# EAGLE schematic STM32 Sismin (EAGLE 9.6.2)
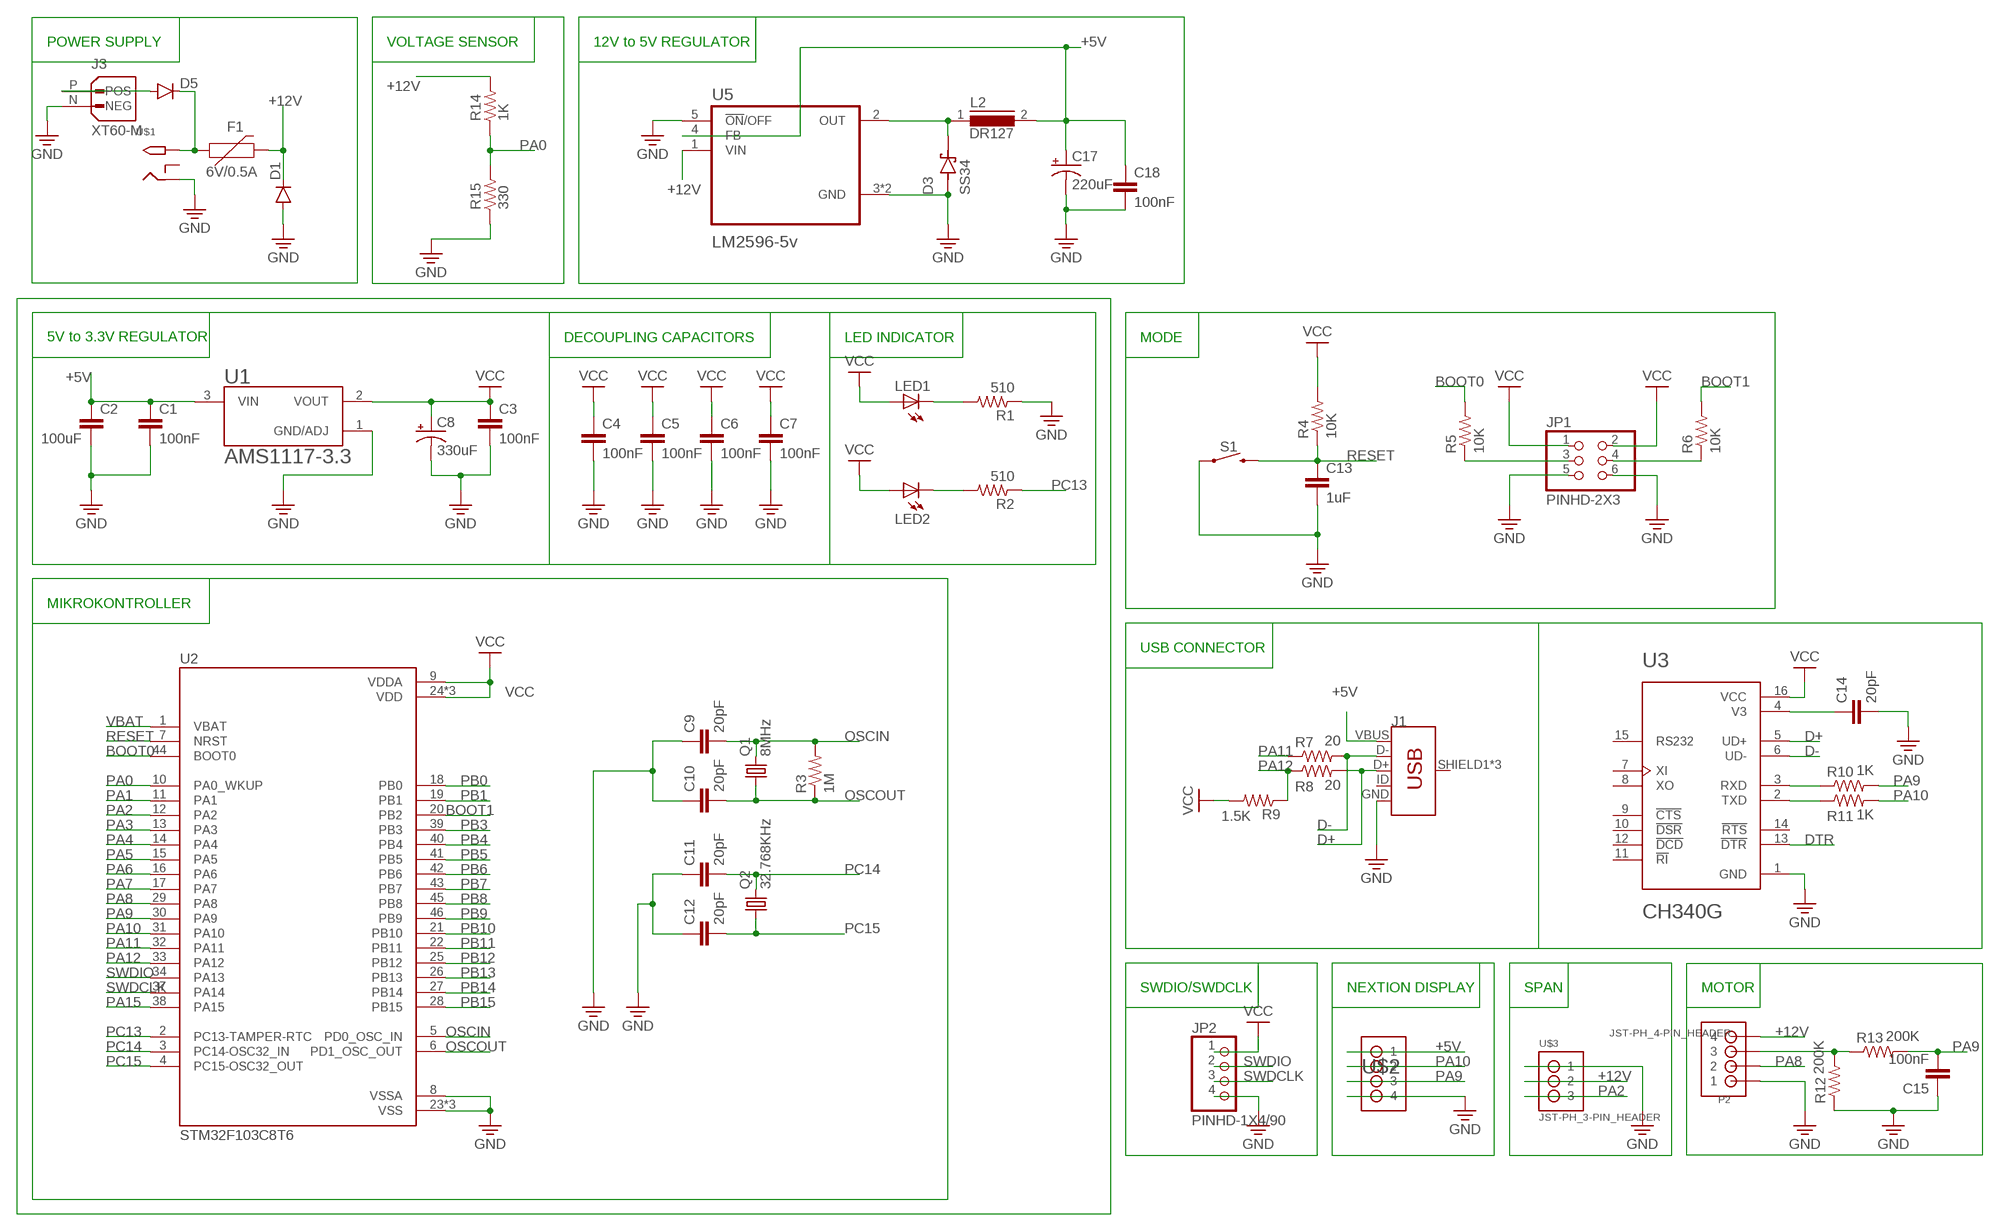
[diagram p0: schematic, sheet 1]

## Parts
C1  100nF  C-EUC1206  [C1206]
C2  100uF  C-EUC1206  [C1206]
C3  100nF  C-EUC1206  [C1206]
C4  100nF  C-EUC1206  [C1206]
C5  100nF  C-EUC1206  [C1206]
C6  100nF  C-EUC1206  [C1206]
C7  100nF  C-EUC1206  [C1206]
C8  330uF  CPOL-USC/6032-28R  [C/6032-28R]
C9  20pF  C-EUC1206  [C1206]
C10  20pF  C-EUC1206  [C1206]
C11  20pF  C-EUC1206  [C1206]
C12  20pF  C-EUC1206  [C1206]
C13  1uF  C-EUC1206  [C1206]
C14  20pF  C-EUC1206  [C1206]
C15  100nF  C-EUC1206  [C1206]
C17  220uF  CPOL-USC/6032-28R  [C/6032-28R]
C18  100nF  C-EUC1206  [C1206]
D1  DIODEDIODE-123FL  [DIODE_SOD-123FL]
D3  SS34  [DIOM6859X262N]
D5  DIODEDIODE-123FL  [DIODE_SOD-123FL]
F1  6V/0.5A  PPTC_HALF-AMP  [1206]
J1  USB_MICRO-BREDUCED_PASTE  [USB-B-MICRO-SMD_RED_PASTE]
J3  XT60-M  [AMASS_XT60-M]
JP1  PINHD-2X3  [2X03]
JP2  PINHD-1X4/90  [1X04/90]
L2  DR127  [DR127]
LED1  LEDCHIPLED_0805  [CHIPLED_0805]
LED2  LEDCHIPLED_0805  [CHIPLED_0805]
P2  JST-PH_4-PIN_HEADER  [JST_B4B-PH_HEADER]
Q1  8MHz  CRYSTALHC49S  [HC49/S]
Q2  32.768KHz  MC-306  [MC-306]
R1  510  RC-MASTER-SMD_R_1206MP  [RC-MASTER-SMD_R1206MP]
R2  510  RC-MASTER-SMD_R_1206MP  [RC-MASTER-SMD_R1206MP]
R3  1M  CRCW08050000Z0EA  [RES_0805]
R4  10K  RC-MASTER-SMD_R_1206MP  [RC-MASTER-SMD_R1206MP]
R5  10K  RC-MASTER-SMD_R_1206MP  [RC-MASTER-SMD_R1206MP]
R6  10K  RC-MASTER-SMD_R_1206MP  [RC-MASTER-SMD_R1206MP]
R7  20  RC-MASTER-SMD_R_1206MP  [RC-MASTER-SMD_R1206MP]
R8  20  RC-MASTER-SMD_R_1206MP  [RC-MASTER-SMD_R1206MP]
R9  1.5K  RC-MASTER-SMD_R_1206MP  [RC-MASTER-SMD_R1206MP]
R10  1K  RC-MASTER-SMD_R_1206MP  [RC-MASTER-SMD_R1206MP]
R11  1K  RC-MASTER-SMD_R_1206MP  [RC-MASTER-SMD_R1206MP]
R12  200K  RC-MASTER-SMD_R_1206MP  [RC-MASTER-SMD_R1206MP]
R13  200K  RC-MASTER-SMD_R_1206MP  [RC-MASTER-SMD_R1206MP]
R14  1K  RC-MASTER-SMD_R_1206MP  [RC-MASTER-SMD_R1206MP]
R15  330  RC-MASTER-SMD_R_1206MP  [RC-MASTER-SMD_R1206MP]
S1  MOMENTARY-SWITCH-SPST-SMD-6.0X3.5MM  [TACTILE_SWITCH_SMD_6.0X3.5MM]
U1  AMS1117-3.3  [SOT229P700X180-4N]
U2  STM32F103C8T6  [QFP50P900X900X160-48N]
U3  CH340G  [SOIC127P600X180-16N]
U5  LM2596-5v  LM2596SX-ADJ/NOPB  [VREG_LM2596SX-ADJ/NOPB]
U$1  2.1MMJACKSMT  [DCJACK_2MM_SMT]
U$2  JST-PH_4-PIN_HEADER  [JST_B4B-PH_HEADER]
U$3  JST-PH_3-PIN_HEADER  [JST_B3B-PH_HEADER]

## Nets
+5V: C1.1 C2.1 C17.+ C18.1 J1.VBUS L2.2 U1.3(VIN) U5.4(FB) U$2.P1
+12V: D1.C F1.2 P2.P4 R14.2 U5.1(VIN) U$3.P2
BOOT0: R5.2 U2.44(BOOT0)
BOOT1: R6.2 U2.20(PB2)
D+: J1.D+ R8.2 U3.5(UD+)
D-: J1.D- R7.2 U3.6(UD-)
DTR: U3.13(!DTR)
GND: C1.2 C2.2 C3.2 C4.2 C5.2 C6.2 C7.2 C8.- C9.1 C10.1 C11.1 C12.1 C13.2 C14.2 C15.1 C17.- C18.2 D1.A D3.A J1.GND J3.N(NEG) JP1.5 JP1.6 JP2.4 P2.P1 R1.1 R12.1 R15.1 S1.1 U1.1(GND/ADJ) U2.8(VSSA) U2.23(VSS) U2.35(VSS) U2.47(VSS) U3.1(GND) U5.3(GND) U5.5(!ON!/OFF) U5.6(GND) U$1.GND(RING) U$2.P4 U$3.P1
N$3: JP1.3 R5.1
N$4: JP1.4 R6.1
N$5: R10.1 U3.3(RXD)
N$6: LED1.C R1.2
N$7: LED2.C R2.2
N$9: R11.1 U3.2(TXD)
N$10: C14.1 U3.4(V3)
N$14: P2.P3 R12.2 R13.1
N$17: D3.C(K) L2.1 U5.2(OUT)
N$22: D5.C F1.1 U$1.PWR2(TIP)
N$28: D5.A J3.P(POS)
OSCIN: C9.2 Q1.2 R3.2 U2.5(PD0_OSC_IN)
OSCOUT: C10.2 Q1.1 R3.1 U2.6(PD1_OSC_OUT)
PA0: R14.1 R15.2 U2.10(PA0_WKUP)
PA1: U2.11(PA1)
PA2: U2.12(PA2) U$3.P3
PA3: U2.13(PA3)
PA4: U2.14(PA4)
PA5: U2.15(PA5)
PA6: U2.16(PA6)
PA7: U2.17(PA7)
PA8: P2.P2 U2.29(PA8)
PA9: C15.2 R10.2 R13.2 U2.30(PA9) U$2.P3
PA10: R11.2 U2.31(PA10) U$2.P2
PA11: R7.1 U2.32(PA11)
PA12: R8.1 R9.1 U2.33(PA12)
PA15: U2.38(PA15)
PB0: U2.18(PB0)
PB1: U2.19(PB1)
PB3: U2.39(PB3)
PB4: U2.40(PB4)
PB5: U2.41(PB5)
PB6: U2.42(PB6)
PB7: U2.43(PB7)
PB8: U2.45(PB8)
PB9: U2.46(PB9)
PB10: U2.21(PB10)
PB11: U2.22(PB11)
PB12: U2.25(PB12)
PB13: U2.26(PB13)
PB14: U2.27(PB14)
PB15: U2.28(PB15)
PC13: R2.1 U2.2(PC13-TAMPER-RTC)
PC14: C11.2 Q2.4 U2.3(PC14-OSC32_IN)
PC15: C12.2 Q2.1 U2.4(PC15-OSC32_OUT)
RESET: C13.1 R4.1 S1.2 U2.7(NRST)
SWDCLK: JP2.3 U2.37(PA14)
SWDIO: JP2.2 U2.34(PA13)
VBAT: U2.1(VBAT)
VCC: C3.1 C4.1 C5.1 C6.1 C7.1 C8.+ JP1.1 JP1.2 JP2.1 LED1.A LED2.A R4.2 R9.2 U1.2(VOUT) U2.9(VDDA) U2.24(VDD) U2.36(VDD) U2.48(VDD) U3.16(VCC)
Unconnected: J1.ID J1.SHIELD1(SHIELD) J1.SHIELD2(SHIELD) J1.SHIELD3(SHIELD) U3.7(XI) U3.8(XO) U3.9(!CTS) U3.10(!DSR) U3.11(!RI) U3.12(!DCD) U3.14(!RTS) U3.15(RS232) U$1.GNDBREAK(RING_SW)

## Notes on the sheet
- POWER SUPPLY | VOLTAGE SENSOR | 12V to 5V REGULATOR
- DECOUPLING CAPACITORS | LED INDICATOR | MODE
- 5V to 3.3V REGULATOR
- MIKROKONTROLLER
- USB CONNECTOR
- SWDIO/SWDCLK | NEXTION DISPLAY | SPAN | MOTOR

## Library data of the parts
C1-C7 C9-C15 C18 = rcl:C-EU: CAPACITOR, European symbol; SPICEPREFIX: C
C8 C17 = rcl:CPOL-US: POLARIZED CAPACITOR, American symbol; SPICEPREFIX: C
D1 D5 = BeagleBone_Blue_R3:DIODE: Diode These are standard reverse protection diodes and small signal diodes. SMA package can handle up to about 1A. SOD-323 can handle about 200mA. What the SOD-323 package when ordering, there are some mfgs out there that are 5-pin packages.
D3 = SS34:SS34: Check availability <https://pricing.snapeda.com/parts/SS34/Taiwan%20Semiconductor/view-part?ref=eda>; AVAILABILITY: In Stock; DESCRIPTION: 3A, 40V, Schottky Rectifier; MF: Taiwan Semiconductor; MP: SS34; PACKAGE: SMC-2 Taiwan Semiconductor; PRICE: None; PURCHASE-URL: https://pricing.snapeda.com/search/part/SS34/?ref=eda
F1 = SparkFun-Fuses:PPTC: Resettable Fuse PPTC Resettable Fuse. Really a sort of resistor with a polymeric positive temperature coefficient whose resistance increases dramatically with an increase in temperature. When heated by the power passing through the resistance rises causing the current to be limited, protecting the circuit. This is achieved by the transition of the polymer from a crystalline to an amorphous state where the conductive carbon separates breaking the conductive pathways found in the cool crystalline structure. When a PPTC cools back down it resumes conducting letting the circuit turn back on. SparkFun Products: SparkFun RedBoard - Programmed with Arduino <https://www.sparkfun.com/products/12757> Pro Micro - 5V/16MHz <https://www.sparkfun.com/products/12640> Arduino Pro 328 - 5V/16MHz <https://www.sparkfun.com/products/10915> MP3 Trigger <https://www.sparkfun.com/products/13720>; PROD_ID: RES-08585
J1 = SparkFun-Connectors:USB_MICRO-B: USB Type Micro-B Connector Male/female and PTH/SMT variants SparkFun Products: SparkFun microB USB Breakout <https://www.sparkfun.com/products/12035> SparkFun USB microB Plug Breakout <https://www.sparkfun.com/products/10031> SparkFun ESP8266 Thing <https://www.sparkfun.com/products/13231>; PROD_ID: CONN-11752
J3 = XT60-M:XT60-M: Check availability <https://pricing.snapeda.com/parts/XT60-M/AMASS/view-part?ref=eda>; AVAILABILITY: Not in stock; DESCRIPTION: Plug; DC supply; XT60; male; PIN: 2; for cable; soldered; 30A; 500V; MF: AMASS; MP: XT60-M; PACKAGE: Package; PRICE: None
JP1 = Connector:PINHD-2X3: PIN HEADER; CATEGORY: CONNECTOR; SUB-CATEGORY: PIN-HEADER
JP2 = Connector:PINHD-1X4: PIN HEADER; CATEGORY: CONNECTOR; SUB-CATEGORY: PIN-HEADER
L2 = inductors:DR127: High Power Density, High Efficiency, Shielded Inductors Source: coiltronics_dr_series.pdf; SPICEPREFIX: L
LED1 LED2 = adafruit:LED: LED OSRAM: - CHIPLED LG R971, LG N971, LY N971, LG Q971, LY Q971, LO R971, LY R971 LH N974, LH R974 LS Q976, LO Q976, LY Q976 LO Q996 - Hyper CHIPLED LW Q18S LB Q993, LB Q99A, LB R99A - SideLED LS A670, LO A670, LY A670, LG A670, LP A670 LB A673, LV A673, LT A673, LW A673 LH A674 LY A675 LS A676, LA A676, LO A676, LY A676, LW A676 LS A679, LY A679, LG A679 - Hyper Micro SIDELED® LS Y876, LA Y876, LO Y876, LY Y876 LT Y87S - SmartLED LW L88C, LW L88S LB L89C, LB L89S, LG L890 LS L89K, LO L89K, LY L89K LS L896, LA L896, LO L896, LY L896 - TOPLED LS T670, LO T670, LY T670, LG T670, LP T670 LSG T670, LSP T670, LSY T670, LOP T670, LYG T670 LG T671, LOG T671, LSG T671 LB T673, LV T673, LT T673, LW T673 LH T674 LS T676, LA T676, LO T676, LY T676, LB T676, LH T676, LSB T676, LW T676 LB T67C, LV T67C, LT T67C, LS T67K, LO T67K, LY T67K, LW E67C LS E67B, LA E67B, LO E67B, LY E67B, LB E67C, LV E67C, LT E67C LW T67C LS T679, LY T679, LG T679 LS T770, LO T770, LY T770, LG T770, LP T770 LB T773, LV T773, LT T773, LW T773 LH T774 LS E675, LA E675, LY E675, LS T675 LS T776, LA T776, LO T776, LY T776, LB T776 LHGB T686 LT T68C, LB T68C - Hyper Mini TOPLED® LB M676 - Mini TOPLED Santana® LG M470 LS M47K, LO M47K, LY M47K Source: http://www.osram.convergy.de/
P2 U$2 = SRG:JST-PH_4-PIN_HEADER: 4-pin JST PH Shrouded Header, top entry P/N B4B-PH-K-S Mating connector PHR-4 Mating cable assembly: Sparkfun PRT-09916 <http://www.sparkfun.com/products/9916>
Q1 = adafruit:CRYSTAL: CRYSTAL; OC_FARNELL: 1667008; OC_NEWARK: unknown
Q2 = crystal:MC-306: kHz RANGE CRYSTAL UNIT SMD Source: MC-306_405_406_E07X.PDF Homepage <http://www.epsontoyocom.co.jp>; MPN: MC-306 60.0KHZ 100PPM ,12.5PF; OC_FARNELL: 1278040; OC_NEWARK: 31M5576
R1 R2 R4-R15 = 52101-101-REV-A_v16:RC-MASTER-SMD_R_: RESISTOR
R3 = Resistor_Capacitor:CRCW08050000Z0EA: RES SMD 0 OHM JUMPER 1/8W 0805 Manufacturer's datasheet <http://www.vishay.com/docs/20035/dcrcwe3.pdf>; CREATED_BY: PCBLayout.com; DIGIKEY_PART_NUMBER: 541-0.0ATR-ND; MANUFACTURER: Vishay Dale; MPN: CRCW08050000Z0EA; PACKAGE: SMD 0805
S1 = SparkFun-Switches:MOMENTARY-SWITCH-SPST: Momentary Switch (Pushbutton) - SPST Normally-open (NO) SPST momentary switches (buttons, pushbuttons). Variants PTH-12MM - 12mm square, through-hole Momentary Pushbutton Switch - 12mm Square <https://www.sparkfun.com/products/9190> (COM-09190) PTH-6.0MM, PTH-6.0MM-KIT - 6.0mm square, through-hole Mini Pushbutton Switch <https://www.sparkfun.com/products/97> (COM-00097) KIT package intended for soldering kit's - only one side of pads' copper is exposed. PTH-RIGHT-ANGLE-KIT - Right-angle, through-hole Right Angle Tactile Button <https://www.sparkfun.com/products/10791> - Used on SparkFun BigTime Watch Kit <https://www.sparkfun.com/products/11734> SMD-12MM - 12mm square, surface-mount Tactile Button - SMD (12mm) <https://www.sparkfun.com/products/12993> (COM-12993) Used on SparkFun PicoBoard <https://www.sparkfun.com/products/11888> SMD-4.5MM - 4.5mm Square Trackball Switch Used on SparkFun Blackberry Trackballer Breakout <https://www.sparkfun.com/products/13169> SMD-4.6MMX2.8MM - 4.60mm x 2.80mm, surface mount Used on SparkFun SAMD21 Mini Breakout <https://www.sparkfun.com/products/13664> SMD-5.2MM, SMD-5.2-REDUNDANT - 5.2mm square, surface-mount Mini Pushbutton Switch - SMD <https://www.sparkfun.com/products/8720> (COM-08720) Used on Arduino Pro Mini <https://www.sparkfun.com/products/11114> REDUNDANT package connects both switch circuits together SMD-6.0X3.5MM - 6.0 x 3.5mm, surface mount Momentary Reset Switch SMD <https://www.sparkfun.com/products/8229> (COM-08229) SMD-6.2MM-TALL - 6.2mm square, surface mount Tactile Button - SMD (6mm) <https://www.sparkfun.com/products/12992> Used on SparkFun Digital Sandbox <https://www.sparkfun.com/products/12651> SMD-RIGHT-ANGLE - Right-angle, surface mount Used on SparkFun Block for Intel® Edison - Arduino <https://www.sparkfun.com/products/13036>; PROD_ID: SWCH-00815; SF_SKU: COM-08229
U1 = AMS1117-3.3:AMS1117-3.3: Check availability <https://pricing.snapeda.com/parts/AMS1117-3.3/Advanced%20Monolithic%20Systems/view-part?ref=eda>; AVAILABILITY: In Stock; DESCRIPTION: Sot223/Pkg 1-Amp 3.3-Volt Low Drop Out Voltage Regulatator; MF: Advanced Monolithic Systems; MP: AMS1117-3.3; PACKAGE: SOT-223 Seeed Technology; PRICE: None; PURCHASE-URL: https://pricing.snapeda.com/search/part/AMS1117-3.3/?ref=eda
U2 = STM32F103C8T6:STM32F103C8T6: Mainstream Performance line, ARM Cortex-M3 MCU with 64 Kbytes Flash, 72 MHz CPU, motor control, USB and CAN Check availability <https://pricing.snapeda.com/parts/STM32F103C8T6/STMicroelectronics/view-part?ref=eda>; AVAILABILITY: In Stock; DESCRIPTION: ARM® Cortex®-M3 STM32F1 Microcontroller IC 32-Bit 72MHz 64KB (64K x 8) FLASH 48-LQFP (7x7); MF: STMicroelectronics; MP: STM32F103C8T6; PACKAGE: LQFP-48 STMicroelectronics; PRICE: None; PURCHASE-URL: https://pricing.snapeda.com/search/part/STM32F103C8T6/?ref=eda
U3 = CH340G:CH340G: Check availability <https://pricing.snapeda.com/parts/Ch340G/WCH/view-part?ref=eda>; AVAILABILITY: Not in stock; DESCRIPTION: USB Interface Integrated Circuit; MF: WCH; MP: Ch340G; PACKAGE: None; PRICE: None
U5 = LM2596SX-ADJ_NOPB:LM2596SX-ADJ/NOPB: Check availability <https://pricing.snapeda.com/parts/LM2596SX-ADJ/NOPB/Texas%20Instruments/view-part?ref=eda>; AVAILABILITY: In Stock; DESCRIPTION: SIMPLE SWITCHER&reg; 4.5V to 40V, 3A Low Component Count Step-Down Regulator; MF: Texas Instruments; MP: LM2596SX-ADJ/NOPB; PACKAGE: TO-263-5 Texas Instruments; PRICE: None; PURCHASE-URL: https://pricing.snapeda.com/search/part/LM2596SX-ADJ/NOPB/?ref=eda
U$1 = adafruit:2.1MMJACK: 2.1mm x 5.5mm THM DC jack with internal switch. Digikey part #PJ-102A, 4UCON part #05537 2.1mm x 5.5mm SMT DC jack with internal switch. Digikey part #PJ-002A-SMT, 4UCON part #03267 By microbuilder.eu & adafruit.com
U$3 = SRG:JST-PH_3-PIN_HEADER: 3-pin JST PH Shrouded Header, top entry P/N B3B-PH-K-S Mating connector PHR-3